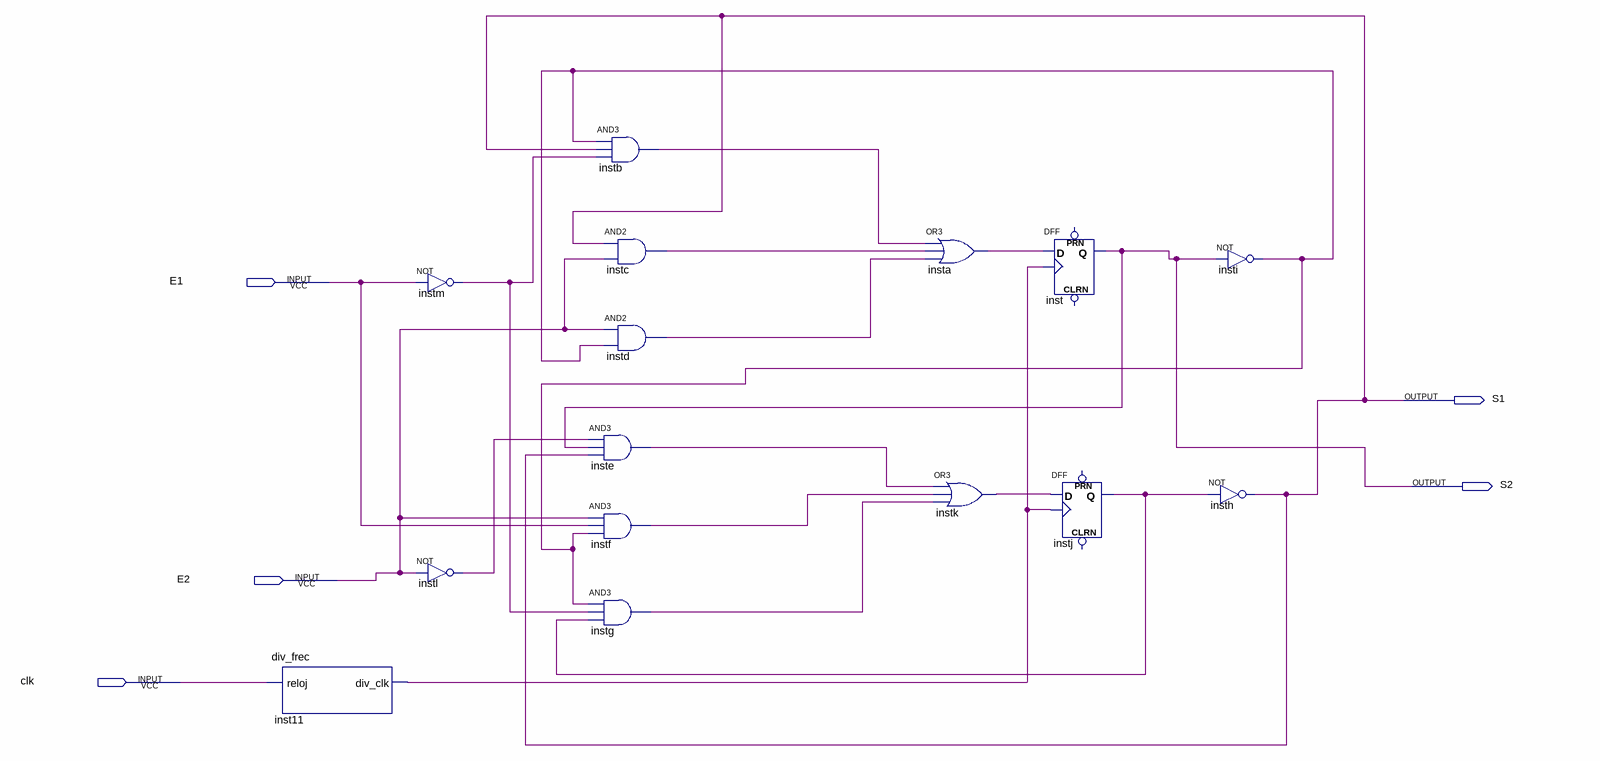
[diagram p0: schematic sheet]
// Quartus schematic practica2_ff.bdf as structural Verilog: 15 symbols, 5 pins
module practica2_ff (
  input  E1,
  input  E2,
  input  clk,
  output S1,
  output S2
);

  wire inst11_div_clk, insta_out, instb_out, instc_out, instd_out, inste_out, instf_out, instg_out,
       insti_out, instj_q, instk_out, instl_out, instm_out;

  div_frec inst11 (.reloj(clk), .div_clk(inst11_div_clk));
  not instm (instm_out, E1);
  not instl (instl_out, E2);
  and inste (inste_out, instl_out, S2, S1);
  and instf (instf_out, E2, E1, insti_out);
  and instg (instg_out, insti_out, instm_out, instj_q);
  and instb (instb_out, insti_out, S1, instm_out);
  and instc (instc_out, S1, E2);
  and instd (instd_out, E2, insti_out);
  or insta (insta_out, instb_out, instc_out, instd_out);
  or instk (instk_out, inste_out, instf_out, instg_out);
  DFF inst (.CLK(inst11_div_clk), .D(insta_out), .Q(S2));  // open: CLRN, PRN
  DFF instj (.CLK(inst11_div_clk), .D(instk_out), .Q(instj_q));  // open: CLRN, PRN
  not insti (insti_out, S2);
  not insth (S1, instj_q);
endmodule
